# Altium project PCB Version 0.2.PrjPcb
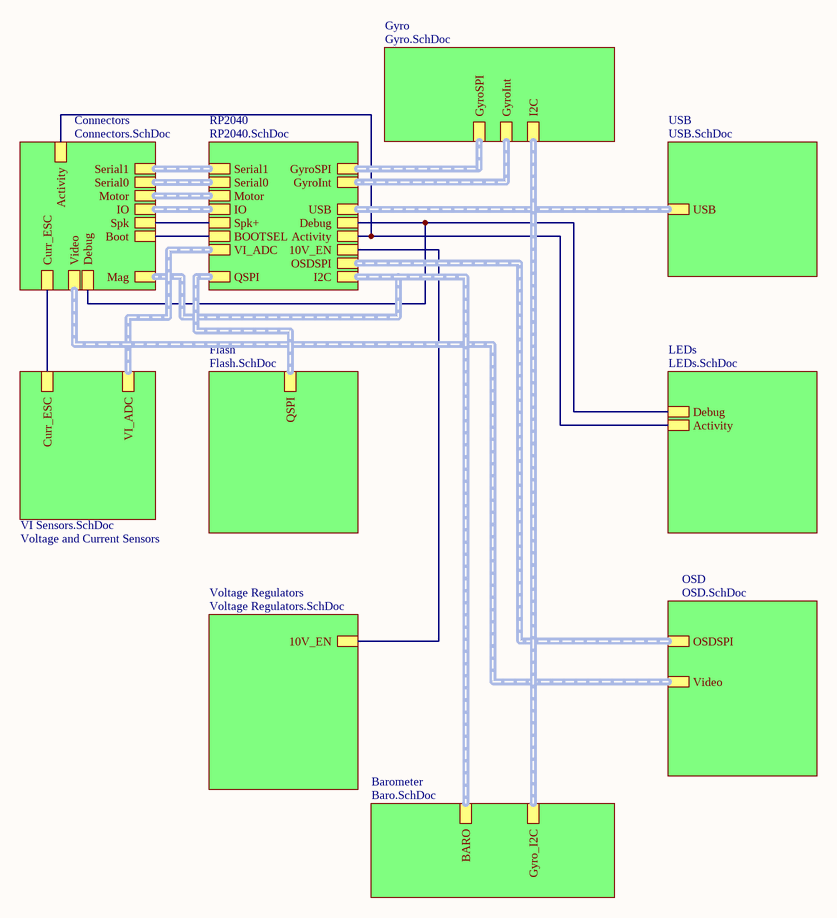
[diagram p0: Main.SchDoc]
10 sheets, 137 parts. Net scope: hierarchical (ports join the sheet entries above them; power ports are global).
Board file: PCB v0.2.PcbDoc
Sheets:
  Main.SchDoc
    RP2040 = RP2040.SchDoc
    Flash = Flash.SchDoc
    Voltage Regulators = Voltage Regulators.SchDoc
    USB = USB.SchDoc
    OSD = OSD.SchDoc
    Barometer = Baro.SchDoc
    Gyro = Gyro.SchDoc
    Connectors = Connectors.SchDoc
    Voltage and Current Sensors = VI Sensors.SchDoc

## Sheet Main.SchDoc
size A4; SheetNumber: 1; SheetTotal: 11

### Sub-sheets
Barometer = Baro.SchDoc: BARO, Gyro_I2C
Connectors = Connectors.SchDoc: Serial1, Motor, Mag, Serial0, Curr_ESC, IO, Video, Spk, Debug, Activity, Boot
Flash = Flash.SchDoc: QSPI
Gyro = Gyro.SchDoc: GyroSPI, GyroInt, I2C
LEDs = LEDs.SchDoc (file not in this document): Debug, Activity
OSD = OSD.SchDoc: OSDSPI, Video
RP2040 = RP2040.SchDoc: QSPI, USB, Debug, Activity, I2C, OSDSPI, GyroSPI, GyroInt, Serial1, Motor, Serial0, VI_ADC, IO, Spk+, 10V_EN, BOOTSEL
USB = USB.SchDoc: USB
Voltage and Current Sensors = VI Sensors.SchDoc: Curr_ESC, VI_ADC
Voltage Regulators = Voltage Regulators.SchDoc: 10V_EN

### Nets
Activity: sheet RP2040/Activity, sheet LEDs/Activity, sheet Connectors/Activity
Curr_ESC: sheet Connectors/Curr_ESC, sheet Voltage and Current Sensors/Curr_ESC
Debug: sheet RP2040/Debug, sheet LEDs/Debug, sheet Connectors/Debug
IO6: sheet RP2040/10V_EN, sheet Voltage Regulators/10V_EN
Spk+: sheet RP2040/Spk+, sheet Connectors/Spk
NetIC2_1: sheet RP2040/BOOTSEL, sheet Connectors/Boot

### Buses and harness runs
harness sheet Barometer/BARO = sheet Connectors/Mag = sheet RP2040/I2C
harness sheet Barometer/Gyro_I2C = sheet Gyro/I2C
harness sheet Connectors/IO = sheet RP2040/IO
harness sheet Connectors/Motor = sheet RP2040/Motor
harness sheet Connectors/Serial0 = sheet RP2040/Serial0
harness sheet Connectors/Serial1 = sheet RP2040/Serial1
harness sheet Connectors/Video = sheet OSD/Video
harness sheet Flash/QSPI = sheet RP2040/QSPI
harness sheet Gyro/GyroInt = sheet RP2040/GyroInt
harness sheet Gyro/GyroSPI = sheet RP2040/GyroSPI
harness sheet OSD/OSDSPI = sheet RP2040/OSDSPI
harness sheet RP2040/USB = sheet USB/USB
harness sheet RP2040/VI_ADC = sheet Voltage and Current Sensors/VI_ADC

## Sheet RP2040.SchDoc
size A4; SheetNumber: 2; SheetTotal: 11
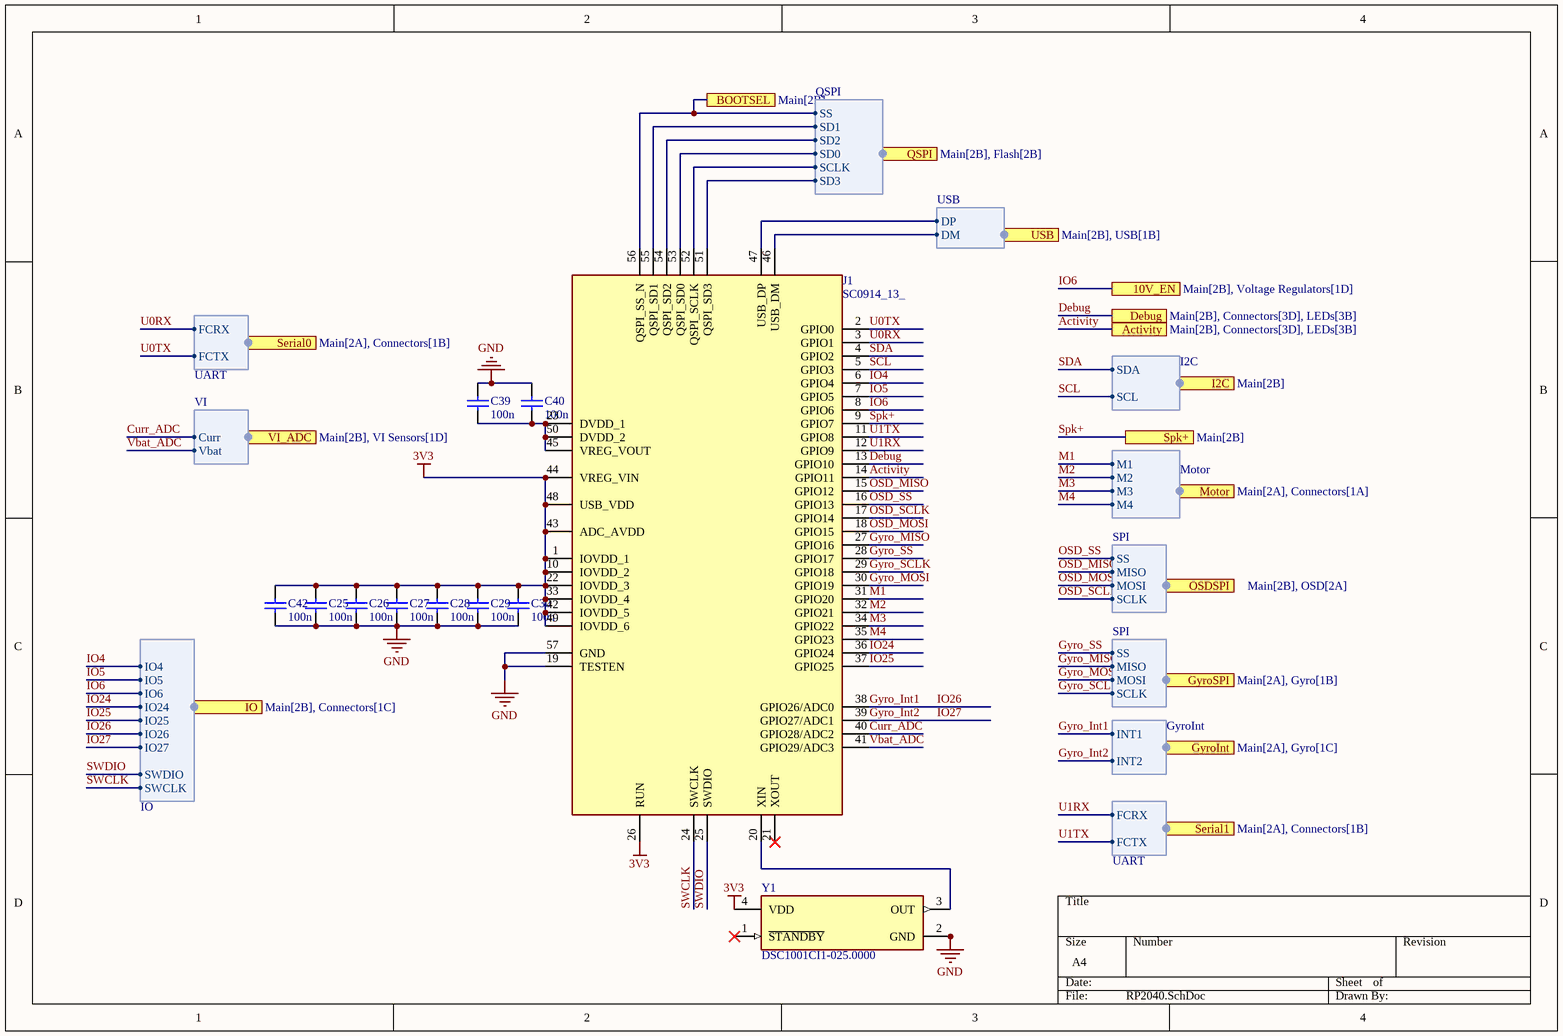
[diagram p1: RP2040.SchDoc]

### Parts
C25  100n  [CAPC0603(1608)55_N]
C26  100n  [CAPC0603(1608)55_N]
C27  100n  [CAPC0603(1608)55_N]
C28  100n  [CAPC0603(1608)55_N]
C29  100n  [CAPC0603(1608)55_N]
C30  100n  [CAPC0603(1608)55_N]
C39  100n  [CAPC0603(1608)55_N]
C40  100n  [CAPC0603(1608)55_N]
C42  100n  [CAPC0603(1608)55_N]
J1  SC0914_13_  [SC091413]
Y1  DSC1001CI1-025.0000  [FP-CDFN3225-4LD-PL-1-MFG]

### Ports
10V_EN (see Main[2B], Voltage Regulators[1D]), Activity (see Main[2B], Connectors[3D], LEDs[3B]), BOOTSEL (see Main[2B]), Debug (see Main[2B], Connectors[3D], LEDs[3B]), GyroInt (harness GyroInt, see Main[2A], Gyro[1C]), GyroSPI (harness SPI, see Main[2A], Gyro[1B]), I2C (harness I2C, see Main[2B]), IO (harness IO, see Main[2B], Connectors[1C]), Motor (harness Motor, see Main[2A], Connectors[1A]), OSDSPI (harness SPI, see Main[2B], OSD[2A]), QSPI (harness QSPI, see Main[2B], Flash[2B]), Serial0 (harness UART, see Main[2A], Connectors[1B]), Serial1 (harness UART, see Main[2A], Connectors[1B]), Spk+ (see Main[2B]), USB (harness USB, see Main[2B], USB[1B]), VI_ADC (harness VI, see Main[2B], VI Sensors[1D])

### Harnesses
QSPI: SS, SD1, SD2, SD0, SCLK, SD3
USB: DP, DM
I2C: SDA, SCL
SPI: SS, MISO, MOSI, SCLK
GyroInt: INT1, INT2
UART: FCRX, FCTX
Motor: M2, M4, M1, M3
VI: Curr, Vbat
IO: IO4, IO5, IO6, IO24, IO25, IO26, IO27, SWDIO, SWCLK

### Nets
3V3: C25.2 C26.2 C27.2 C28.2 C29.2 C30.2 C42.2 J1.1(IOVDD_1) J1.10(IOVDD_2) J1.22(IOVDD_3) J1.26(RUN) J1.33(IOVDD_4) J1.42(IOVDD_5) J1.43(ADC_AVDD) J1.44(VREG_VIN) J1.48(USB_VDD) J1.49(IOVDD_6) Y1.4(VDD)
GND: C25.1 C26.1 C27.1 C28.1 C29.1 C30.1 C39.2 C40.2 C42.1 J1.19(TESTEN) J1.57(GND) Y1.2(GND)
Activity: J1.14(GPIO11) ; port Activity
Curr_ADC: J1.40(GPIO28/ADC2) ; port VI_ADC.Curr
Debug: J1.13(GPIO10) ; port Debug
Gyro_Int1: J1.38(GPIO26/ADC0) ; port GyroInt.INT1, port IO.IO26  [also labelled IO26]
Gyro_Int2: J1.39(GPIO27/ADC1) ; port GyroInt.INT2, port IO.IO27  [also labelled IO27]
Gyro_MISO: J1.27(GPIO16) ; port GyroSPI.MISO
Gyro_MOSI: J1.30(GPIO19) ; port GyroSPI.MOSI
Gyro_SCLK: J1.29(GPIO18) ; port GyroSPI.SCLK
Gyro_SS: J1.28(GPIO17) ; port GyroSPI.SS  [project net CSB]
IO4: J1.6(GPIO4) ; port IO.IO4
IO5: J1.7(GPIO5) ; port IO.IO5
IO6: J1.8(GPIO6) ; port 10V_EN, port IO.IO6
IO24: J1.36(GPIO24) ; port IO.IO24
IO25: J1.37(GPIO25) ; port IO.IO25
M1: J1.31(GPIO20) ; port Motor.M1
M2: J1.32(GPIO21) ; port Motor.M2
M3: J1.34(GPIO22) ; port Motor.M3
M4: J1.35(GPIO23) ; port Motor.M4
OSD_MISO: J1.15(GPIO12) ; port OSDSPI.MISO  [project net MISO]
OSD_MOSI: J1.18(GPIO15) ; port OSDSPI.MOSI  [project net MOSI]
OSD_SCLK: J1.17(GPIO14) ; port OSDSPI.SCLK
OSD_SS: J1.16(GPIO13) ; port OSDSPI.SS
SCL: J1.5(GPIO3) ; port I2C.SCL
SDA: J1.4(GPIO2) ; port I2C.SDA
Spk+: J1.9(GPIO7) ; port Spk+
SWCLK: J1.24(SWCLK) ; port IO.SWCLK
SWDIO: J1.25(SWDIO) ; port IO.SWDIO
U0RX: J1.3(GPIO1) ; port Serial0.FCRX
U0TX: J1.2(GPIO0) ; port Serial0.FCTX
U1RX: J1.12(GPIO9) ; port Serial1.FCRX
U1TX: J1.11(GPIO8) ; port Serial1.FCTX
Vbat_ADC: J1.41(GPIO29/ADC3) ; port VI_ADC.Vbat
NetC39_1: C39.1 C40.1 J1.23(DVDD_1) J1.45(VREG_VOUT) J1.50(DVDD_2)
NetIC2_1: J1.56(QSPI_SS_N) ; port BOOTSEL, port QSPI.SS
NetIC2_2: J1.55(QSPI_SD1) ; port QSPI.SD1
NetIC2_3: J1.54(QSPI_SD2) ; port QSPI.SD2
NetIC2_5: J1.53(QSPI_SD0) ; port QSPI.SD0
NetIC2_6: J1.52(QSPI_SCLK) ; port QSPI.SCLK
NetIC2_7: J1.51(QSPI_SD3) ; port QSPI.SD3
NetJ1_20: J1.20(XIN) Y1.3(OUT)
NetJ1_46: J1.46(USB_DM) ; port USB.DM
NetJ1_47: J1.47(USB_DP) ; port USB.DP

Not connected (* = marked no-connect by the designer): J1 21(XOUT)*; Y1 1(~{STANDBY})*

### Library data of the parts
C25-C30 C39 C40 C42 = Cap 100n: Keramikvielschichtkondensator, SMD, Baureihe MC, ± 20%; Manufacturer: Multicomp; OC_FARNELL: 1759038; Value: 100n; PackageReference: 0603
J1 = SC0914_13_: Connector; Manufacturer_Name: RASPBERRY-PI; Manufacturer_Part_Number: SC0914(13); Datasheet Link: https://datasheets.raspberrypi.com/rp2040/rp2040-datasheet.pdf; Height: 0.9mm; Mouser Part Number: 358-SC091413; Mouser Price/Stock: https://www.mouser.co.uk/ProductDetail/Raspberry-Pi/SC091413?qs=T%252BzbugeAwjhr%252BUbBr3TJcw%3D%3D
Y1 = CMP-06255-000034-1: MEMS OSC XO 25.0000MHZ CMOS SMD; Load Capacitance: 15pF; Max Supply Voltage: 3.6V; Min Supply Voltage: 2.7V; Max Supply Current: 6.3mA; Frequency Stability: 50ppm; Frequency: 25MHz; Max Duty Cycle: 55%; Number of Pins: 4; Height: 0.035inch; Packaging: Rail/Tube; Max Operating Temperature: 85°C; Length: 0.126inch; Case/Package: SMD/SMT; Series: DSC1001; Width: 0.098inch; Termination: SMD/SMT; Package Quantity: 110; Mount: Surface Mount; Ratings: AEC-Q100; Min Operating Temperature: -40°C

## Sheet Flash.SchDoc
size A4; SheetNumber: 5; SheetTotal: 11
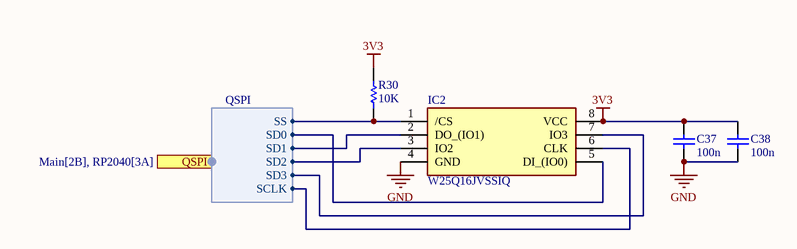
[diagram p2: Flash.SchDoc]

### Parts
C37  100n  [CAPC0603(1608)55_N]
C38  100n  [CAPC0603(1608)55_N]
IC2  W25Q16JVSSIQ  [SOIC127P790X216-8N]
R30  10K  [RESC0603(1608)_N]

### Ports
QSPI (harness QSPI, see Main[2B], RP2040[3A])

### Harnesses
QSPI: SS, SD0, SD1, SD2, SD3, SCLK

### Nets
3V3: C37.2 C38.2 IC2.8(VCC) R30.2
GND: C37.1 C38.1 IC2.4(GND)
NetIC2_1: IC2.1(/CS) R30.1 ; port QSPI.SS
NetIC2_2: IC2.2(DO_(IO1)) ; port QSPI.SD1
NetIC2_3: IC2.3(IO2) ; port QSPI.SD2
NetIC2_5: IC2.5(DI_(IO0)) ; port QSPI.SD0
NetIC2_6: IC2.6(CLK) ; port QSPI.SCLK
NetIC2_7: IC2.7(IO3) ; port QSPI.SD3

### Library data of the parts
C37 C38 = Cap 100n: as C25 on sheet RP2040; OC_FARNELL: 1759038; Value: 100n; PackageReference: 0603
IC2 = W25Q16JVSSIQ: Integrated Circuit; Manufacturer_Name: Winbond; Datasheet Link: https://www.winbond.com/hq/search-resource-file.jsp?partNo=W25Q16JVSSIQ&type=datasheet; Height: 2.16mm; Manufacturer_Part_Number: W25Q16JVSSIQ; Mouser Part Number: 454-W25Q16JVSSIQ; Mouser Price/Stock: https://www.mouser.co.uk/ProductDetail/Winbond/W25Q16JVSSIQ?qs=qSfuJ%252Bfl%2Fd46L%2F1QrQC%2Fog%3D%3D; Arrow Part Number: W25Q16JVSSIQ; Arrow Price/Stock: https://www.arrow.com/en/products/w25q16jvssiq/winbond-electronics?region=nac
R30 = Res 100K: Chipwiderstand, SMD, Baureihe MC, 1%; Manufacturer: Multicomp; Value: 100K; PackageReference: 0603; OC_FARNELL: 9330402

## Sheet Voltage Regulators.SchDoc
size A4; SheetNumber: 4; SheetTotal: 11
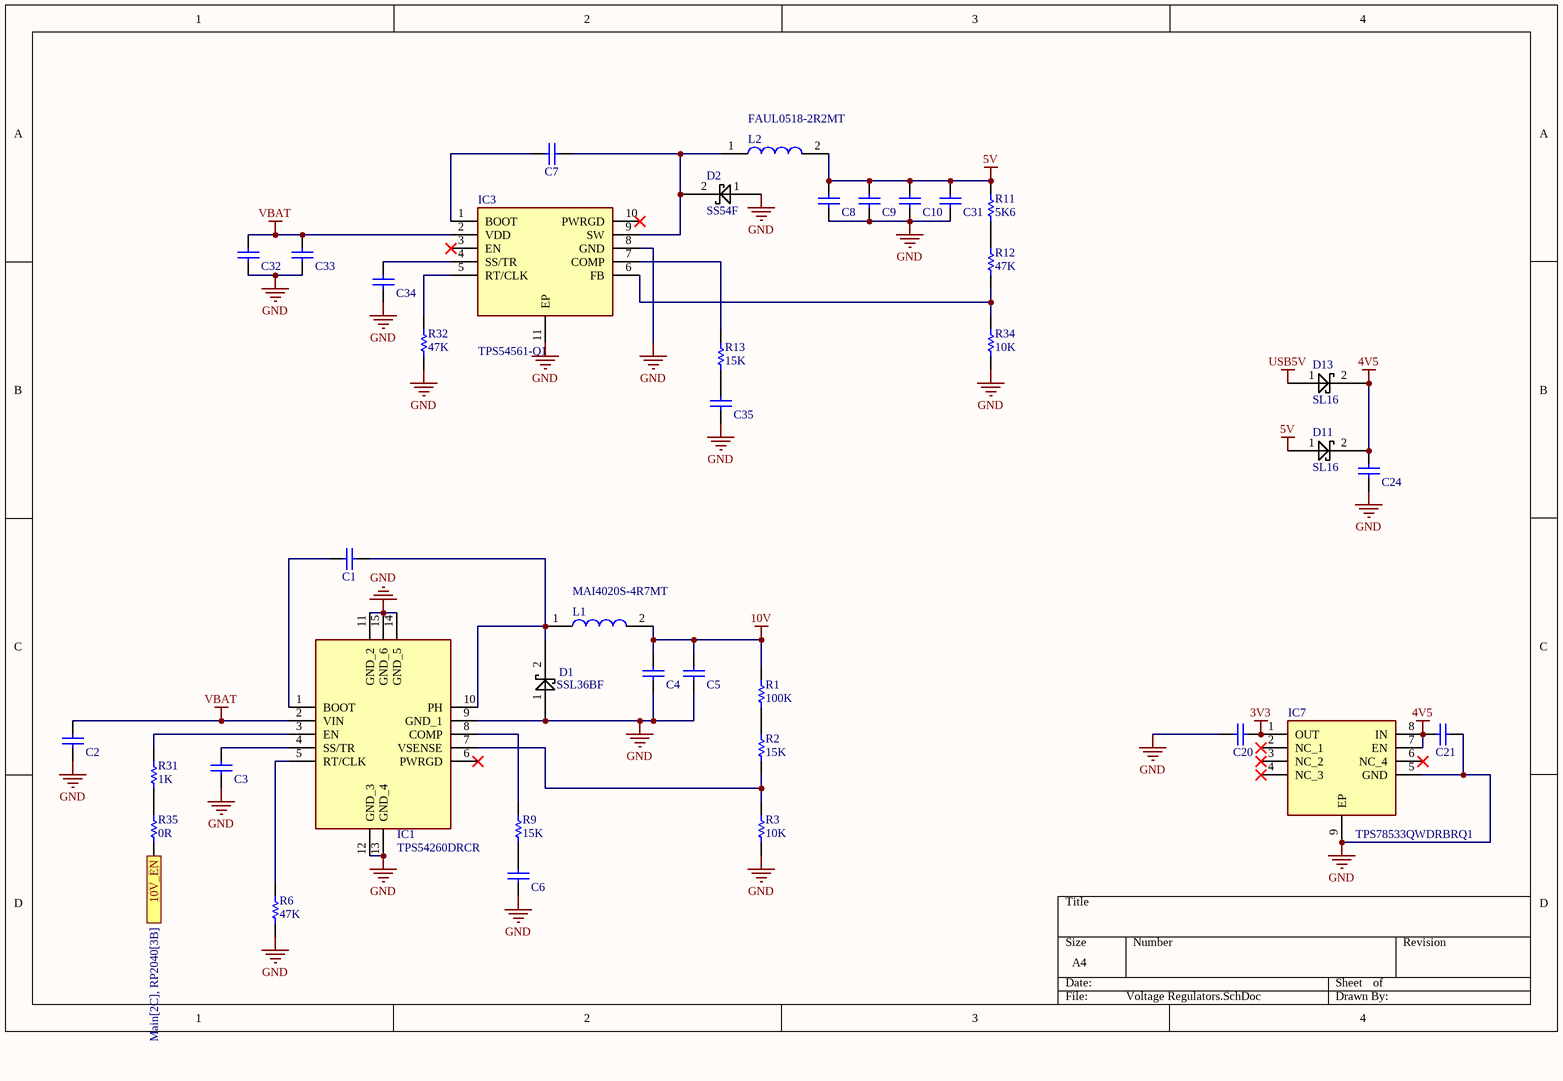
[diagram p3: Voltage Regulators.SchDoc]

### Parts
C1  100nF  [WCAP-CSGP_0603_L1.6W0.8H0.8_Reflow]  (value not drawn)
C2  3.3µF  [WCAP-CSGP_1206_L3.2W1.6H1.6]  (value not drawn)
C3  10nF  [WCAP-CSGP_0603_L1.6W0.8H0.8_Reflow]  (value not drawn)
C4  4.7µF  [WCAP-CSGP_0805_L2W1.25H1.25]  (value not drawn)
C5  4.7µF  [WCAP-CSGP_0805_L2W1.25H1.25]  (value not drawn)
C6  2.5pF  [WCAP-CSGP_0603_L1.6W0.8H0.8_Reflow]  (value not drawn)
C7  100nF  [WCAP-CSGP_0603_L1.6W0.8H0.8_Reflow]  (value not drawn)
C8  4.7µF  [WCAP-CSGP_0805_L2W1.25H1.25]  (value not drawn)
C9  4.7µF  [WCAP-CSGP_0805_L2W1.25H1.25]  (value not drawn)
C10  4.7µF  [WCAP-CSGP_0805_L2W1.25H1.25]  (value not drawn)
C20  1µF  [WCAP-CSGP_0603_L1.6W0.8H0.8_Reflow]  (value not drawn)
C21  1µF  [WCAP-CSGP_0603_L1.6W0.8H0.8_Reflow]  (value not drawn)
C24  1µF  [WCAP-CSGP_0603_L1.6W0.8H0.8_Reflow]  (value not drawn)
C31  4.7µF  [WCAP-CSGP_0805_L2W1.25H1.25]  (value not drawn)
C32  2.2µF  [WCAP-CSGP_0805_L2W1.25H1.25]  (value not drawn)
C33  2.2µF  [WCAP-CSGP_0805_L2W1.25H1.25]  (value not drawn)
C34  10nF  [WCAP-CSGP_0603_L1.6W0.8H0.8_Reflow]  (value not drawn)
C35  1nF  [WCAP-CSGP_0603_L1.6W0.8H0.8_Reflow]  (value not drawn)
D1  SSL36BF  [SSL36BF]
D2  SS54F  [SS54F]
D11  SL16  [SL16]
D13  SL16  [SL16]
IC1  TPS54260DRCR  [TPS54040ADRCT]
IC3  TPS54561-Q1  [SON80P400X400X80-11N]
IC7  TPS78533QWDRBRQ1  [SON65P300X300X100-9N-D]
L1  MAI4020S-4R7MT  [MAI4020S-4R7MT]
L2  FAUL0518-2R2MT  [FAUL0518-2R2MT]
R1  100K  [RESC0603(1608)_N]
R2  15K  [RESC0603(1608)_N]
R3  10K  [RESC0603(1608)_N]
R6  47K  [RESC0603(1608)_N]
R9  15K  [RESC0603(1608)_N]
R11  5K6  [RESC0603(1608)_N]
R12  47K  [RESC0603(1608)_N]
R13  15K  [RESC0603(1608)_N]
R31  1K  [RESC0603(1608)_N]
R32  47K  [RESC0603(1608)_N]
R34  10K  [RESC0603(1608)_N]
R35  0R  [RESC0603(1608)_N]

### Ports
10V_EN (see Main[2C], RP2040[3B])

### Nets
3V3: C20.2 IC7.1(OUT)
4V5: C21.1 C24.2 D11.2 D13.2 IC7.7(EN) IC7.8(IN)
5V: C8.2 C9.2 C10.2 C31.2 D11.1 L2.2 R11.2
10V: C4.2 C5.2 L1.2 R1.2
GND: C2.1 C3.1 C4.1 C5.1 C6.1 C8.1 C9.1 C10.1 C20.1 C21.2 C24.1 C31.1 C32.1 C33.1 C34.1 C35.1 D1.1 D2.1 IC1.9(GND_1) IC1.11(GND_2) IC1.12(GND_3) IC1.13(GND_4) IC1.14(GND_5) IC1.15(GND_6) IC3.8(GND) IC3.11(EP) IC7.5(GND) IC7.9(EP) R3.1 R6.1 R32.1 R34.1
USB5V: D13.1
VBAT: C2.2 C32.2 C33.2 IC1.2(VIN) IC3.2(VDD)
IO6: R35.1 ; port 10V_EN
NetC1_1: C1.1 IC1.1(BOOT)
NetC1_2: C1.2 D1.2 IC1.10(PH) L1.1
NetC3_2: C3.2 IC1.4(SS/TR)
NetC6_2: C6.2 R9.1
NetC7_1: C7.1 IC3.1(BOOT)
NetC7_2: C7.2 D2.2 IC3.9(SW) L2.1
NetC34_2: C34.2 IC3.4(SS/TR)
NetC35_2: C35.2 R13.1
NetIC1_3: IC1.3(EN) R31.2
NetIC1_5: IC1.5(RT/CLK) R6.2
NetIC1_7: IC1.7(VSENSE) R2.1 R3.2
NetIC1_8: IC1.8(COMP) R9.2
NetIC3_5: IC3.5(RT/CLK) R32.2
NetIC3_6: IC3.6(FB) R12.1 R34.2
NetIC3_7: IC3.7(COMP) R13.2
NetR1_1: R1.1 R2.2
NetR11_1: R11.1 R12.2
NetR31_1: R31.1 R35.2

Not connected (* = marked no-connect by the designer): IC1 6(PWRGD)*; IC3 3(EN)* 10(PWRGD)*; IC7 2(NC_1)* 3(NC_2)* 4(NC_3)* 6(NC_4)*

### Library data of the parts
C1 C7 = 885012206046: WCAP-CSGP Multilayer Ceramic Chip Capacitor, General Purpose, size 0603, X7R, 100nF, 16VDC; Manufacturer: Wurth Elektronik; Case/Size Code: 0603; Capacitance Tolerance: +/-10%; Dissipation Factor: 3.5%; Insulation Resistance: 5GΩ; Rated Voltage (DC): 16V; Technical Reference: X7R0603104K016DFCT10000; ComponentLink1Description: Website Link; ComponentLink1URL: https://www.we-online.com/redexpert/article/885012206046?ad; ComponentLink2Description: Datasheet Link; ComponentLink2URL: https://www.we-online.com/redexpert/spec/885012206046?ad; Manufacturer Part Number: 885012206046; Category: Multilayer Ceramic Chip Capacitors; Match Code: WCAP-CSGP; Mount: Surface Mount; Operating Temperature Max: 125°C; Operating Temperature Min: -55°C; Packaging: Tape and Reel; Length: 1.6mm; Width: 0.8mm; Height: 0.8mm; Capacitance: 100nF; Ceramic Type: X7R
C2 = 885012208124: TDK C3216X7S2A335KT000N / 3.3µF MLCC 1206 100V X7S; Manufacturer: Wurth Elektronik; Match Code: WCAP-CSGP; Case/Size Code: 1206; Capacitance: 2.2µF; Capacitance Tolerance: +/-10%; Ceramic Type: X7R; Dissipation Factor: 5%; Insulation Resistance: 0.05GΩ; Technical Reference: X7R1206225K100DFCT10000; ComponentLink1Description: Website Link; ComponentLink1URL: https://www.we-online.com/redexpert/article/885012208124?ad; ComponentLink2Description: Datasheet Link; ComponentLink2URL: https://www.we-online.com/redexpert/spec/885012208124?ad; Manufacturer Part Number: 885012208124; Category: Multilayer Ceramic Chip Capacitors; Mount: Surface Mount; Operating Temperature Max: 125°C; Operating Temperature Min: -55°C; Packaging: Tape and Reel; Length: 3.2mm; Width: 1.6mm; Height: 1.6mm; Rated Voltage (DC): 100V
C3 C34 = 885012206040: WCAP-CSGP Multilayer Ceramic Chip Capacitor, General Purpose, size 0603, X7R, 10nF, 16VDC; Manufacturer: Wurth Elektronik; Case/Size Code: 0603; Capacitance Tolerance: +/-10%; Dissipation Factor: 3.5%; Insulation Resistance: 10GΩ; Rated Voltage (DC): 16V; Technical Reference: X7R0603103K016DFCT10000; ComponentLink1Description: Website Link; ComponentLink1URL: https://www.we-online.com/redexpert/article/885012206040?ad; ComponentLink2Description: Datasheet Link; ComponentLink2URL: https://www.we-online.com/redexpert/spec/885012206040?ad; Manufacturer Part Number: 885012206040; Category: Multilayer Ceramic Chip Capacitors; Match Code: WCAP-CSGP; Mount: Surface Mount; Operating Temperature Max: 125°C; Operating Temperature Min: -55°C; Packaging: Tape and Reel; Length: 1.6mm; Width: 0.8mm; Height: 0.8mm; Capacitance: 10nF; Ceramic Type: X7R
C4 C5 C8-C10 C31 = 885012107013: CL21A475KAQNNNG; Manufacturer: Wurth Elektronik; Match Code: WCAP-CSGP; Case/Size Code: 0805; Capacitance Tolerance: +/-20%; Ceramic Type: X5R; Dissipation Factor: 10%; Insulation Resistance: 0.02GΩ; Rated Voltage (DC): 16V; Technical Reference: X5R0805475M016DFCT10000; ComponentLink1Description: Website Link; ComponentLink1URL: https://www.we-online.com/redexpert/article/885012107013?ad; ComponentLink2Description: Datasheet Link; ComponentLink2URL: https://www.we-online.com/redexpert/spec/885012107013?ad; Manufacturer Part Number: 885012107013; Category: Multilayer Ceramic Chip Capacitors; Mount: Surface Mount; Operating Temperature Max: 85°C; Operating Temperature Min: -55°C; Packaging: Tape and Reel; Length: 2mm; Width: 1.25mm; Height: 1.25mm; Capacitance: 4.7µF
C6 C35 = 885012006030: TCC0603COG2R5C500CT; Manufacturer: Wurth Elektronik; Match Code: WCAP-CSGP; Case/Size Code: 0603; Capacitance: 4.7pF; Capacitance Tolerance: +/-0.5pF; Ceramic Type: NP0; Insulation Resistance: 10GΩ; Q Factor: 494; Rated Voltage (DC): 25V; Technical Reference: NP006034R7D025DFCT10000; ComponentLink1Description: Website Link; ComponentLink1URL: https://www.we-online.com/redexpert/article/885012006030?ad; ComponentLink2Description: Datasheet Link; ComponentLink2URL: https://www.we-online.com/redexpert/spec/885012006030?ad; Manufacturer Part Number: 885012006030; Category: Multilayer Ceramic Chip Capacitors; Mount: Surface Mount; Operating Temperature Max: 125°C; Operating Temperature Min: -55°C; Packaging: Tape and Reel; Length: 1.6mm; Width: 0.8mm; Height: 0.8mm
C20 C21 = 885012206026: WCAP-CSGP Multilayer Ceramic Chip Capacitor, General Purpose, size 0603, X7R, 1µF, 10VDC; Manufacturer: Wurth Elektronik; Case/Size Code: 0603; Capacitance Tolerance: +/-10%; Dissipation Factor: 10%; Insulation Resistance: 0.1GΩ; Rated Voltage (DC): 10V; Technical Reference: X7R0603105K010DFCT10000; ComponentLink1Description: Website Link; ComponentLink1URL: https://www.we-online.com/redexpert/article/885012206026?ad; ComponentLink2Description: Datasheet Link; ComponentLink2URL: https://www.we-online.com/redexpert/spec/885012206026?ad; Manufacturer Part Number: 885012206026; Category: Multilayer Ceramic Chip Capacitors; Match Code: WCAP-CSGP; Mount: Surface Mount; Operating Temperature Max: 125°C; Operating Temperature Min: -55°C; Packaging: Tape and Reel; Length: 1.6mm; Width: 0.8mm; Height: 0.8mm; Capacitance: 1µF; Ceramic Type: X7R
C24 = 885012106017: WCAP-CSGP Multilayer Ceramic Chip Capacitor, General Purpose, size 0603, X5R, 1µF, 16VDC; Manufacturer: Wurth Elektronik; Case/Size Code: 0603; Capacitance Tolerance: +/-20%; Dissipation Factor: 10%; Insulation Resistance: 0.1GΩ; Rated Voltage (DC): 16V; Technical Reference: X5R0603105M016DFCT10000; ComponentLink1Description: Website Link; ComponentLink1URL: https://www.we-online.com/redexpert/article/885012106017?ad; ComponentLink2Description: Datasheet Link; ComponentLink2URL: https://www.we-online.com/redexpert/spec/885012106017?ad; Manufacturer Part Number: 885012106017; Category: Multilayer Ceramic Chip Capacitors; Match Code: WCAP-CSGP; Mount: Surface Mount; Operating Temperature Max: 85°C; Operating Temperature Min: -55°C; Packaging: Tape and Reel; Length: 1.6mm; Width: 0.8mm; Height: 0.8mm; Capacitance: 1µF; Ceramic Type: X5R
C32 C33 = 885012107013: CL21B225KBYNNNE; Manufacturer: Wurth Elektronik; Match Code: WCAP-CSGP; Case/Size Code: 0805; Capacitance: 4.7µF; Capacitance Tolerance: +/-20%; Ceramic Type: X5R; Dissipation Factor: 10%; Insulation Resistance: 0.02GΩ; Rated Voltage (DC): 16V; Technical Reference: X5R0805475M016DFCT10000; ComponentLink1Description: Website Link; ComponentLink1URL: https://www.we-online.com/redexpert/article/885012107013?ad; ComponentLink2Description: Datasheet Link; ComponentLink2URL: https://www.we-online.com/redexpert/spec/885012107013?ad; Manufacturer Part Number: 885012107013; Category: Multilayer Ceramic Chip Capacitors; Mount: Surface Mount; Operating Temperature Max: 85°C; Operating Temperature Min: -55°C; Packaging: Tape and Reel; Length: 2mm; Width: 1.25mm; Height: 1.25mm
IC1 = TPS54260DRCR: Integrated Circuit; Manufacturer_Name: Texas Instruments; Datasheet Link: http://www.ti.com/lit/gpn/TPS54040A; Height: 1mm; Manufacturer_Part_Number: TPS54260DRCR; Mouser Part Number: 595-TPS54260DRCR; Mouser Price/Stock: https://www.mouser.co.uk/ProductDetail/Texas-Instruments/TPS54260DRCR?qs=O1HRStiETChM7xK%2FSiuP6w%3D%3D; Arrow Part Number: TPS54260DRCR; Arrow Price/Stock: https://www.arrow.com/en/products/tps54260drcr/texas-instruments?region=nac
IC3 = TPS54561-Q1: Integrated Circuit; Manufacturer_Name: Texas Instruments; Datasheet Link: http://www.ti.com/lit/gpn/tps54561-q1; Height: 0.8mm; Manufacturer_Part_Number: TPS54561-Q1
IC7 = TPS78533QWDRBRQ1: Integrated Circuit; Manufacturer_Name: Texas Instruments; Datasheet Link: https://www.arrow.com/en/products/tps78533qwdrbrq1/texas-instruments?region=nac; Height: 1mm; Manufacturer_Part_Number: TPS78533QWDRBRQ1; Mouser Part Number: 595-TPS78533QWDRBRQ1; Mouser Price/Stock: https://www.mouser.co.uk/ProductDetail/Texas-Instruments/TPS78533QWDRBRQ1?qs=iLbezkQI%252BsiNbdqh2Ko9GQ%3D%3D; Arrow Part Number: TPS78533QWDRBRQ1; Arrow Price/Stock: https://www.arrow.com/en/products/tps78533qwdrbrq1/texas-instruments?region=nac
R1 = Res 100K: Chipwiderstand, SMD, Baureihe MC, 1%; Manufacturer: Multicomp; PackageReference: 0603; Value: 100K; OC_FARNELL: 9330402
R2 R9 R12 R13 = Res 12K: Chipwiderstand, SMD, Baureihe MC, 1%; Manufacturer: Multicomp; Value: 12K; PackageReference: 0603; OC_FARNELL: 9330518
R3 R34 = Res 10K: Chipwiderstand, SMD, Baureihe MC, 1%; Manufacturer: Multicomp; PackageReference: 0603; Value: 10K; OC_FARNELL: 9330399
R6 R32 = Res 47R: Chipwiderstand, SMD, Baureihe MC, 1%; Manufacturer: Multicomp; Value: 47R; PackageReference: 0603; OC_FARNELL: 1576259
R11 = Res 100K: as R30 on sheet Flash; PackageReference: 0603; OC_FARNELL: 9330402
R31 = Res 1K: Chipwiderstand, SMD, Baureihe MC, 1%; Manufacturer: Multicomp; PackageReference: 0603; Value: 1K; OC_FARNELL: 9330380
R35 = Res 0R: Chipwiderstand, SMD, Baureihe MC, 1%; Manufacturer: Multicomp; PackageReference: 0603; Value: 0R; OC_FARNELL: 9331662

## Sheet USB.SchDoc
size A4; SheetNumber: 6; SheetTotal: 11
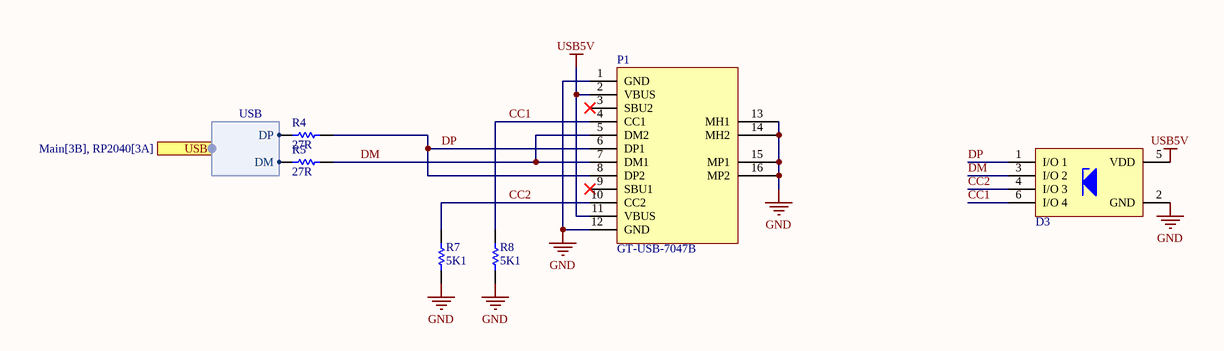
[diagram p4: USB.SchDoc]

### Parts
D3  3.3V  [WE-TVS_SOT23-6L]  (value not drawn)
P1  GT-USB-7047B  [GT-USB-7047B]
R4  27R  [RESC0603(1608)_N]
R5  27R  [RESC0603(1608)_N]
R7  5K1  [RESC0603(1608)_N]
R8  5K1  [RESC0603(1608)_N]

### Ports
USB (harness USB, see Main[3B], RP2040[3A])

### Harnesses
USB: DP, DM

### Nets
GND: D3.2(GND) P1.1(GND) P1.12(GND) P1.13(MH1) P1.14(MH2) P1.15(MP1) P1.16(MP2) R7.1 R8.1
USB5V: D3.5(VDD) P1.2(VBUS) P1.11(VBUS)
CC1: D3.6(I/O_4) P1.4(CC1) R8.2
CC2: D3.4(I/O_3) P1.10(CC2) R7.2
DM: D3.3(I/O_2) P1.5(DM2) P1.7(DM1) R5.2
DP: D3.1(I/O_1) P1.6(DP1) P1.8(DP2) R4.2
NetJ1_46: R5.1 ; port USB.DM
NetJ1_47: R4.1 ; port USB.DP

Not connected (* = marked no-connect by the designer): P1 3(SBU2)* 9(SBU1)*

### Library data of the parts
D3 = 824015043: Shenzhen JingYang TT0514VL; Manufacturer: Wurth Elektronik; Match Code: WE-TVS; Case/Size Code: SOT23-6L; Channel ESD Clamping Voltage: 7.5V; Channel Input Capacitance: 2pF; Channel Reverse Leakage Current: 1µA; ESD Air Discharge Capability: 30kV; Number of Channels: 4+1; Polarity: Unidirectional; (Reverse) Breakdown Voltage: 4.5V; (Reverse) Peak Pulse Current: 30A; ComponentLink1Description: Website Link; ComponentLink1URL: https://www.we-online.com/redexpert/article/824015043?ad; ComponentLink2Description: Datasheet Link; ComponentLink2URL: https://www.we-online.com/redexpert/spec/824015043?ad; Manufacturer Part Number: 824015043; Category: ESD Protection; Mount: Surface Mount; Operating Temperature Max: 125°C; Operating Temperature Min: -55°C; Packaging: Tape and Reel; Length: 2.9mm; Width: 2.8mm; Height: 1.45mm; Channel Operating Voltage: 3.3V; ESD Contact Discharge Capability: 30kV
R4 R5 = Res 27R: Chipwiderstand, Oberflächenmontage, Dickschicht, 27 ohm, 50 V, 0603 [Metrisch 1608], 100 mW, ± 1%; Manufacturer: Multicomp; PackageReference: 0603; Value: 27R; OC_FARNELL: 2447316
R7 R8 = Res 5K6: Chipwiderstand, SMD, Baureihe MC, 5%; Manufacturer: Multicomp; Value: 5K6; PackageReference: 0603; OC_FARNELL: 9332219

## Sheet OSD.SchDoc
size A4; SheetNumber: 7; SheetTotal: 11
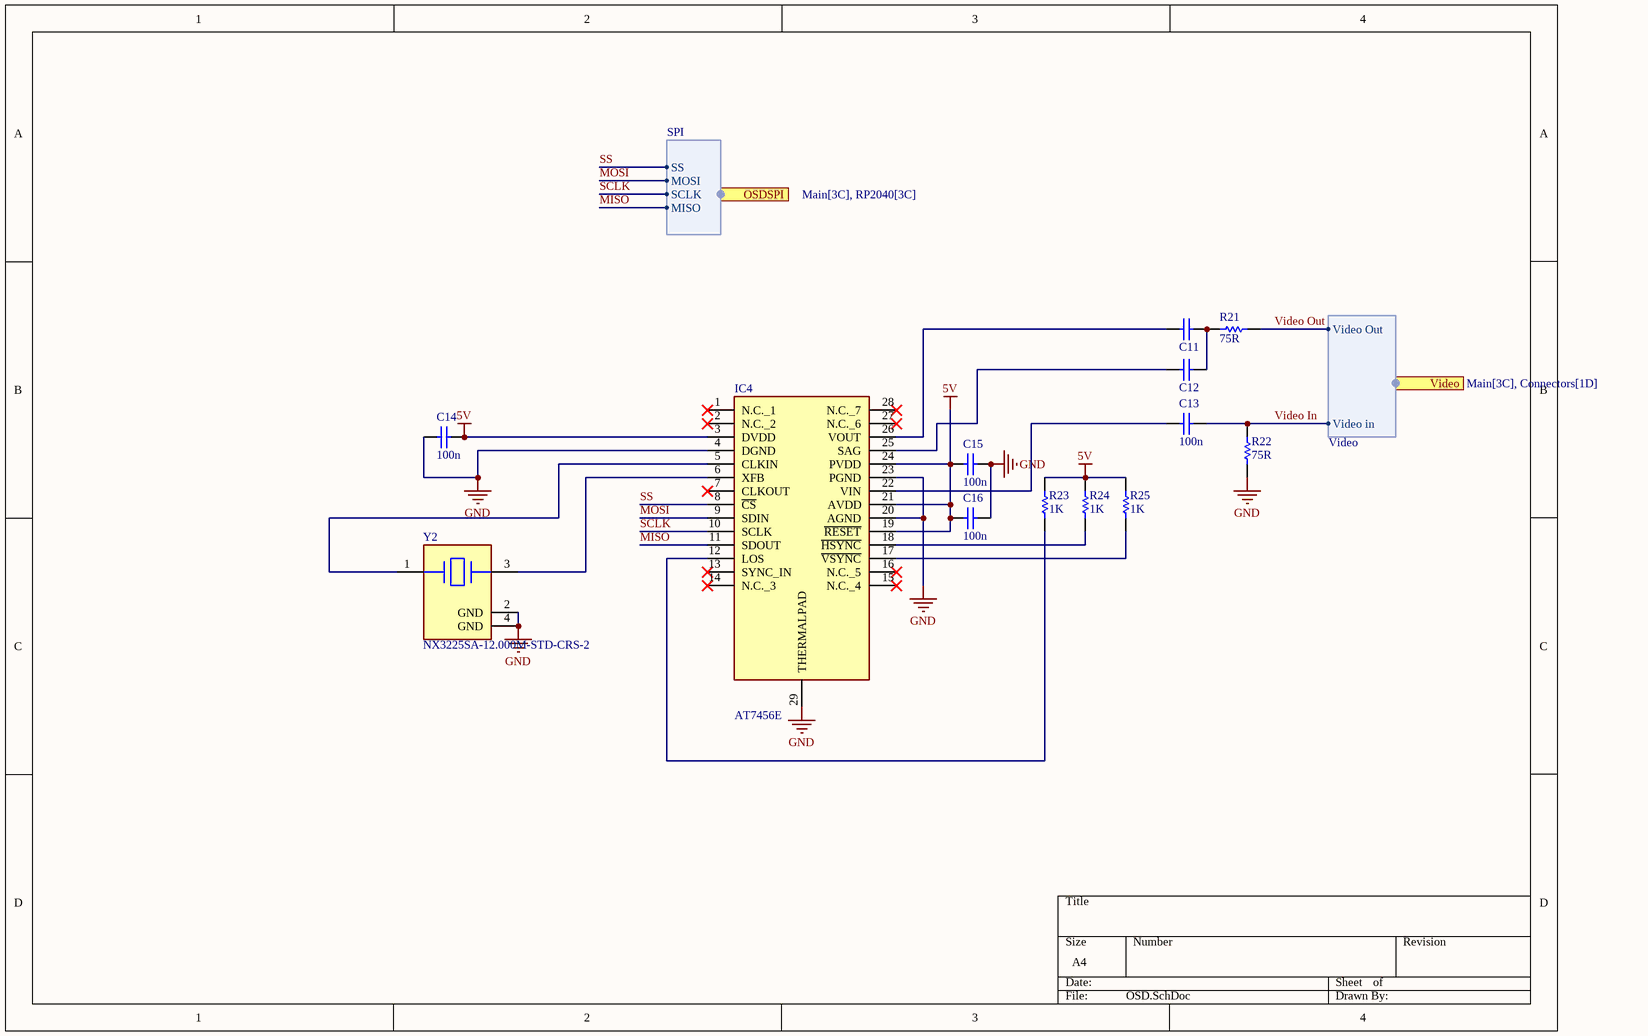
[diagram p5: OSD.SchDoc]

### Parts
C11  10µF  [WCAP-CSGP_0603_L1.6W0.8H0.8_Reflow]  (value not drawn)
C12  10µF  [WCAP-CSGP_0603_L1.6W0.8H0.8_Reflow]  (value not drawn)
C13  100n  [CAPC0603(1608)55_N]
C14  100n  [CAPC0603(1608)55_N]
C15  100n  [CAPC0603(1608)55_N]
C16  100n  [CAPC0603(1608)55_N]
IC4  AT7456E  [SOP65P640X120-29N]
R21  75R  [RESC0603(1608)_N]
R22  75R  [RESC0603(1608)_N]
R23  1K  [RESC0603(1608)_N]
R24  1K  [RESC0603(1608)_N]
R25  1K  [RESC0603(1608)_N]
Y2  NX3225SA-12.000M-STD-CRS-2  [FP-NX3225SA-MFG]

### Ports
OSDSPI (harness SPI, see Main[3C], RP2040[3C]), Video (harness Video, see Main[3C], Connectors[1D])

### Harnesses
SPI: SS, MOSI, SCLK, MISO
Video: Video Out, Video in

### Nets
5V: C14.2 C15.1 C16.1 IC4.3(DVDD) IC4.19(~{RESET}) IC4.21(AVDD) IC4.24(PVDD) R23.2 R24.2 R25.2
GND: C14.1 C15.2 C16.2 IC4.4(DGND) IC4.20(AGND) IC4.23(PGND) IC4.29(THERMALPAD) R22.1 Y2.2(GND) Y2.4(GND)
MISO: IC4.11(SDOUT) ; port OSDSPI.MISO
MOSI: IC4.9(SDIN) ; port OSDSPI.MOSI
SCLK: IC4.10(SCLK) ; port OSDSPI.SCLK  [project net OSD_SCLK]
SS: IC4.8(~{CS}) ; port OSDSPI.SS  [project net OSD_SS]
Video In: C13.2 R22.2 ; port Video.Video in
Video Out: R21.1 ; port Video.Video Out
NetC11_1: C11.1 IC4.26(VOUT)
NetC11_2: C11.2 C12.2 R21.2
NetC12_1: C12.1 IC4.25(SAG)
NetC13_1: C13.1 IC4.22(VIN)
NetIC4_5: IC4.5(CLKIN) Y2.1
NetIC4_6: IC4.6(XFB) Y2.3
NetIC4_12: IC4.12(LOS) R23.1
NetIC4_17: IC4.17(~{VSYNC}) R25.1
NetIC4_18: IC4.18(~{HSYNC}) R24.1

Not connected (* = marked no-connect by the designer): IC4 1(N.C._1)* 2(N.C._2)* 7(CLKOUT)* 13(SYNC_IN)* 14(N.C._3)* 15(N.C._4)* 16(N.C._5)* 27(N.C._6)* 28(N.C._7)*

### Library data of the parts
C11 C12 = 885012106031: WCAP-CSGP Multilayer Ceramic Chip Capacitor, General Purpose, size 0603, X5R, 10µF, 25VDC; Manufacturer: Wurth Elektronik; Case/Size Code: 0603; Capacitance Tolerance: +/20%; Dissipation Factor: 20%; Insulation Resistance: 0.01GΩ; Rated Voltage (DC): 25V; Technical Reference: X5R0603106M025DFCT10000; ComponentLink1Description: Website Link; ComponentLink1URL: https://www.we-online.com/redexpert/article/885012106031?ad; ComponentLink2Description: Datasheet Link; ComponentLink2URL: https://www.we-online.com/redexpert/spec/885012106031?ad; Manufacturer Part Number: 885012106031; Category: Multilayer Ceramic Chip Capacitors; Match Code: WCAP-CSGP; Mount: Surface Mount; Operating Temperature Max: 85°C; Operating Temperature Min: -55°C; Packaging: Tape and Reel; Length: 1.6mm; Width: 0.8mm; Height: 0.8mm; Capacitance: 10µF; Ceramic Type: X5R
C13-C16 = Cap 100n: as C25 on sheet RP2040; OC_FARNELL: 1759038; Value: 100n; PackageReference: 0603
IC4 = AT7456E: Integrated Circuit; Manufacturer_Name: ICOF; Datasheet Link: https://datasheet.lcsc.com/szlcsc/ZHONGKEWEI-AT7456E_C82351.pdf; Height: 1.2mm; Manufacturer_Part_Number: AT7456E
R21 R22 = Res 750R: Chipwiderstand, SMD, Baureihe MC, 1%; Manufacturer: Multicomp; Value: 750R; PackageReference: 0603; OC_FARNELL: 9331506
R23-R25 = Res 1K: as R31 on sheet Voltage Regulators; PackageReference: 0603; Value: 1K; OC_FARNELL: 9330380
Y2 = CMP-200220-000016-1: Frequency Tolerance: 15ppm; Frequency: 12MHz; Frequency Stability: 50ppm; ESR (Equivalent Series Resistance): 120R; Load Capacitance: 8pF; Case/Package: SMD/SMT; RoHS Compliant: Yes; Mount: Surface Mount; Ratings: AEC-Q200; Length: 0.126inch; Packaging: Tape and Reel; Width: 0.098inch; Min Operating Temperature: -40°C; Height: 0.024inch; Max Operating Temperature: 125°C

## Sheet Baro.SchDoc
size A4; SheetNumber: 8; SheetTotal: 11
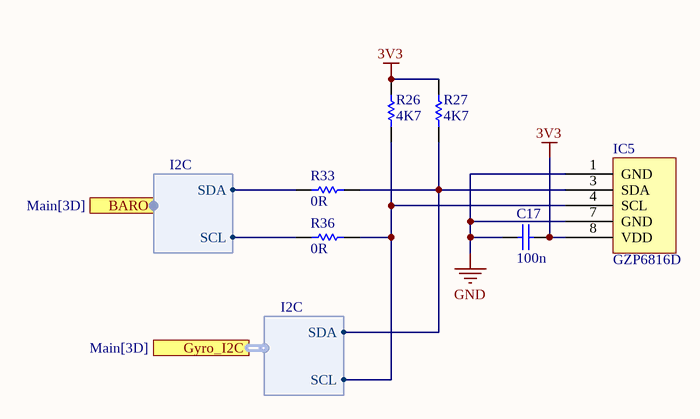
[diagram p6: Baro.SchDoc]

### Parts
C17  100n  [CAPC0603(1608)55_N]
IC5  GZP6816D  [GZP6816D]
R26  4K7  [RESC0603(1608)_N]
R27  4K7  [RESC0603(1608)_N]
R33  0R  [RESC1005X40X25NL05T10]
R36  0R  [RESC1005X40X25NL05T10]

### Ports
BARO (harness I2C, see Main[3D]), Gyro_I2C (harness I2C, see Main[3D])

### Harnesses
I2C: SDA, SCL

### Nets
3V3: C17.1 IC5.8(VDD) R26.2 R27.2
GND: C17.2 IC5.1(GND) IC5.7(GND)
SCL: R36.1 ; port BARO.SCL
SDA: R33.1 ; port BARO.SDA
NetIC5_3: IC5.3(SDA) R27.1 R33.2 ; port Gyro_I2C.SDA
NetIC5_4: IC5.4(SCL) R26.1 R36.2 ; port Gyro_I2C.SCL

### Library data of the parts
C17 = Cap 100n: as C25 on sheet RP2040; OC_FARNELL: 1759038; Value: 100n; PackageReference: 0603
R26 R27 = Res 4k7: Chipwiderstand, SMD, Baureihe MC, 5%; Manufacturer: Multicomp; PackageReference: 0603; Value: 4K7; OC_FARNELL: 9332154
R33 R36 = CMP-1011-00001-2: Manufacturer: Yageo / Phycomp; Part Number: RC0402JR-070RL

## Sheet Gyro.SchDoc
size A4; SheetNumber: 9; SheetTotal: 11
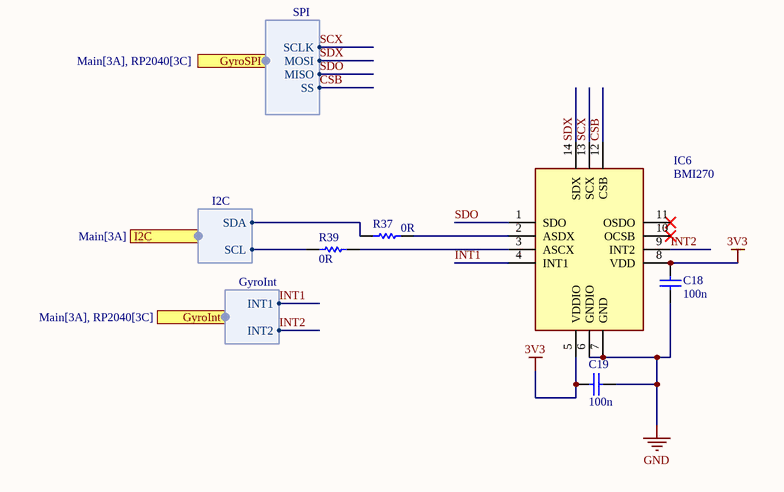
[diagram p7: Gyro.SchDoc]

### Parts
C18  100n  [CAPC0603(1608)55_N]
C19  100n  [CAPC0603(1608)55_N]
IC6  BMI270  [QFN50P300X250X87-14N]
R37  0R  [RESC1005X40X25NL05T10]
R39  0R  [RESC1005X40X25NL05T10]

### Ports
GyroInt (harness GyroInt, see Main[3A], RP2040[3C]), GyroSPI (harness SPI, see Main[3A], RP2040[3C]), I2C (harness I2C, see Main[3A])

### Harnesses
SPI: SS, MISO, MOSI, SCLK
GyroInt: INT1, INT2
I2C: SDA, SCL

### Nets
3V3: C18.2 C19.2 IC6.5(VDDIO) IC6.8(VDD)
GND: C18.1 C19.1 IC6.6(GNDIO) IC6.7(GND)
CSB: IC6.12(CSB) ; port GyroSPI.SS
INT1: IC6.4(INT1) ; port GyroInt.INT1  [project net Gyro_Int1]
INT2: IC6.9(INT2) ; port GyroInt.INT2  [project net Gyro_Int2]
SCX: IC6.13(SCX) ; port GyroSPI.SCLK  [project net Gyro_SCLK]
SDO: IC6.1(SDO) ; port GyroSPI.MISO  [project net Gyro_MISO]
SDX: IC6.14(SDX) ; port GyroSPI.MOSI  [project net Gyro_MOSI]
NetIC5_3: R37.1 ; port I2C.SDA
NetIC5_4: R39.1 ; port I2C.SCL
NetIC6_2: IC6.2(ASDX) R37.2
NetIC6_3: IC6.3(ASCX) R39.2

Not connected (* = marked no-connect by the designer): IC6 10(OCSB)* 11(OSDO)*

### Library data of the parts
C18 C19 = Cap 100n: as C25 on sheet RP2040; OC_FARNELL: 1759038; Value: 100n; PackageReference: 0603
IC6 = BMI270: Integrated Circuit; Manufacturer_Name: BOSCH; Datasheet Link: https://www.mouser.de/datasheet/2/783/BST-BMI270-FL000-1530947.pdf; Height: 0.87mm; Manufacturer_Part_Number: BMI270; Mouser Part Number: 262-BMI270; Mouser Price/Stock: https://www.mouser.co.uk/ProductDetail/Bosch-Sensortec/BMI270?qs=u16ybLDytRYIj%252BjQEee88A%3D%3D; Arrow Part Number: BMI270; Arrow Price/Stock: https://www.arrow.com/en/products/bmi270/bosch?region=nac
R37 R39 = CMP-1011-00001-2: as R33 on sheet Baro

## Sheet Connectors.SchDoc
size A4; SheetNumber: 10; SheetTotal: 11
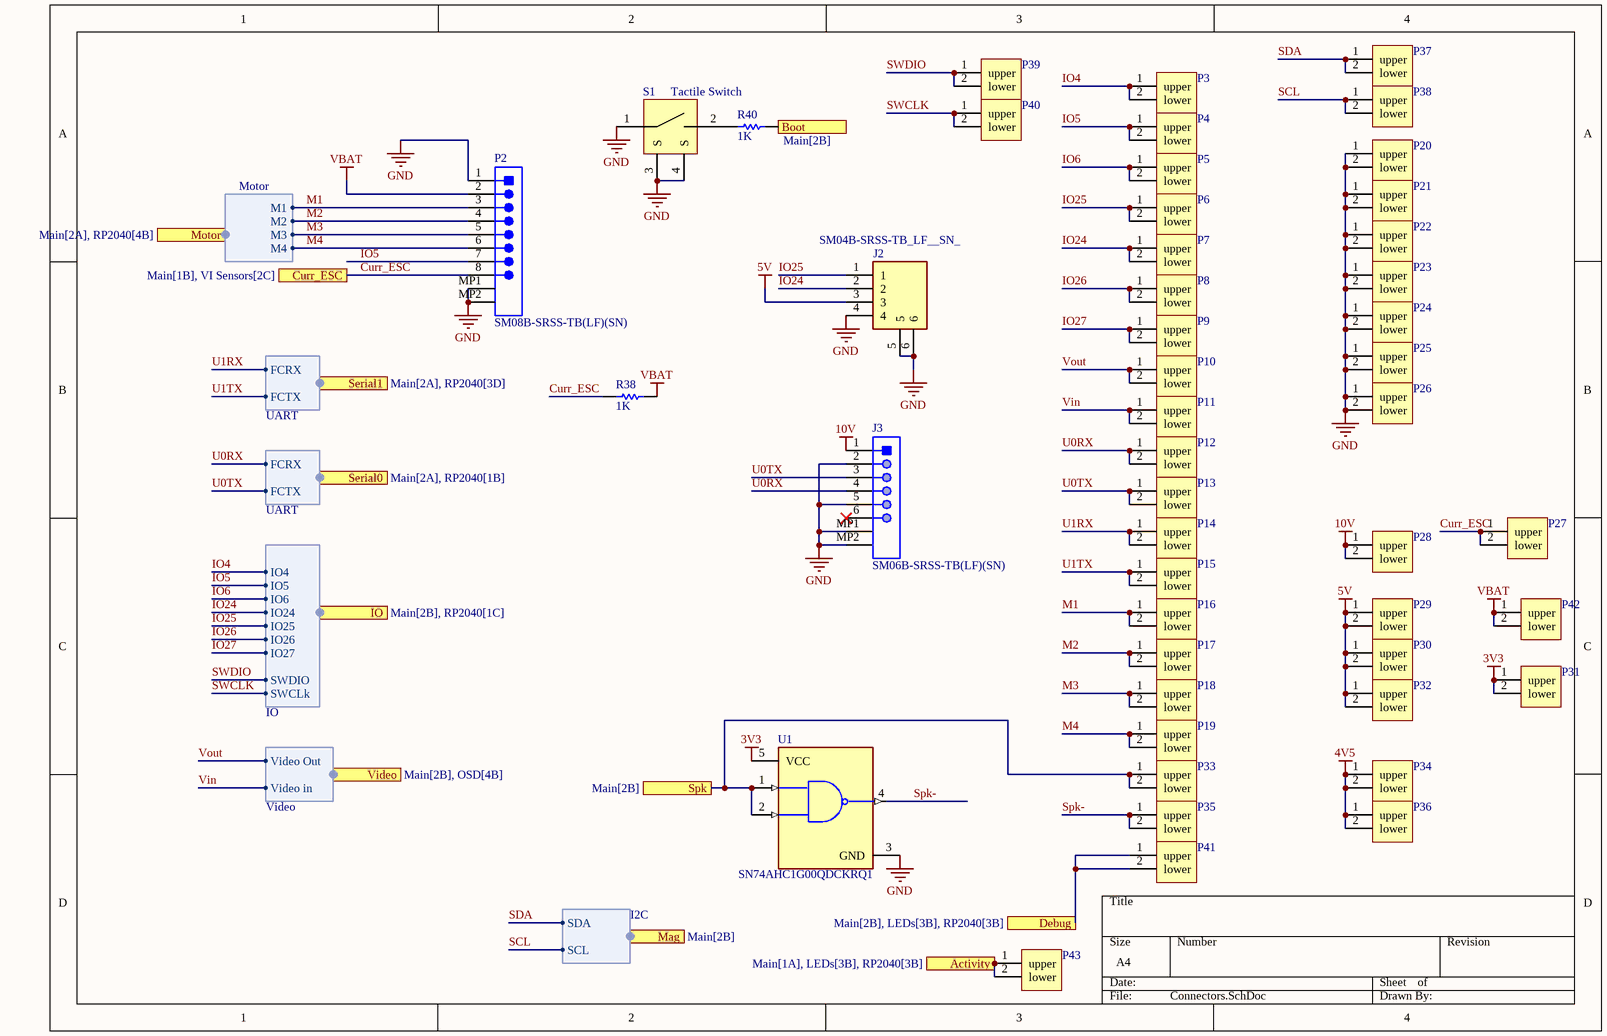
[diagram p8: Connectors.SchDoc]

### Parts
J2  SM04B-SRSS-TB_LF__SN_  [SM04B-SRSS-TB(LFSN)]
J3  SM06B-SRSS-TB(LF)(SN)  [JST-SM06B-SRSS-TB_V]
P2  SM08B-SRSS-TB(LF)(SN)  [JST-SM08B-SRSS-TB_V]
P3  solder pad rounded double sided  [solder pad double sided rounded - duplicate]  (value not drawn)
P4  solder pad rounded double sided  [solder pad double sided rounded - duplicate]  (value not drawn)
P5  solder pad rounded double sided  [solder pad double sided rounded - duplicate]  (value not drawn)
P6  solder pad rounded double sided  [solder pad double sided rounded - duplicate]  (value not drawn)
P7  solder pad rounded double sided  [solder pad double sided rounded - duplicate]  (value not drawn)
P8  solder pad rounded double sided  [solder pad double sided rounded - duplicate]  (value not drawn)
P9  solder pad rounded double sided  [solder pad double sided rounded - duplicate]  (value not drawn)
P10  solder pad rounded double sided  [solder pad double sided rounded - duplicate]  (value not drawn)
P11  solder pad rounded double sided  [solder pad double sided rounded - duplicate]  (value not drawn)
P12  solder pad rounded double sided  [solder pad double sided rounded - duplicate]  (value not drawn)
P13  solder pad rounded double sided  [solder pad double sided rounded - duplicate]  (value not drawn)
P14  solder pad rounded double sided  [solder pad double sided rounded - duplicate]  (value not drawn)
P15  solder pad rounded double sided  [solder pad double sided rounded - duplicate]  (value not drawn)
P16  solder pad rounded double sided  [solder pad double sided rounded - duplicate]  (value not drawn)
P17  solder pad rounded double sided  [solder pad double sided rounded - duplicate]  (value not drawn)
P18  solder pad rounded double sided  [solder pad double sided rounded - duplicate]  (value not drawn)
P19  solder pad rounded double sided  [solder pad double sided rounded - duplicate]  (value not drawn)
P20  solder pad square double sided  [solder pad double sided square]  (value not drawn)
P21  solder pad square double sided  [solder pad double sided square]  (value not drawn)
P22  solder pad square double sided  [solder pad double sided square]  (value not drawn)
P23  solder pad square double sided  [solder pad double sided square]  (value not drawn)
P24  solder pad square double sided  [solder pad double sided square]  (value not drawn)
P25  solder pad square double sided  [solder pad double sided square]  (value not drawn)
P26  solder pad square double sided  [solder pad double sided square]  (value not drawn)
P27  solder pad rounded double sided  [solder pad double sided rounded - duplicate]  (value not drawn)
P28  solder pad chamfered double sided  [solder pad double sided chamfered]  (value not drawn)
P29  solder pad chamfered double sided  [solder pad double sided chamfered]  (value not drawn)
P30  solder pad chamfered double sided  [solder pad double sided chamfered]  (value not drawn)
P31  solder pad chamfered double sided  [solder pad double sided chamfered]  (value not drawn)
P32  solder pad chamfered double sided  [solder pad double sided chamfered]  (value not drawn)
P33  solder pad rounded double sided  [solder pad double sided rounded - duplicate]  (value not drawn)
P34  solder pad chamfered double sided  [solder pad double sided chamfered]  (value not drawn)
P35  solder pad rounded double sided  [solder pad double sided rounded - duplicate]  (value not drawn)
P36  solder pad chamfered double sided  [solder pad double sided chamfered]  (value not drawn)
P37  solder pad rounded double sided  [solder pad double sided rounded - duplicate]  (value not drawn)
P38  solder pad rounded double sided  [solder pad double sided rounded - duplicate]  (value not drawn)
P39  solder pad rounded double sided  [solder pad double sided rounded - duplicate]  (value not drawn)
P40  solder pad rounded double sided  [solder pad double sided rounded - duplicate]  (value not drawn)
P41  solder pad rounded double sided  [solder pad double sided rounded - duplicate]  (value not drawn)
P42  solder pad chamfered double sided  [solder pad double sided chamfered]  (value not drawn)
P43  solder pad rounded double sided  [solder pad double sided rounded - duplicate]  (value not drawn)
R38  1K  [RESC0603(1608)_N]
R40  1K  [RESC1005X40X25NL05T10]
S1  Tactile Switch  [Tactile Switch]
U1  SN74AHC1G00QDCKRQ1  [FP-DCK0005A-IPC_A]

### Ports
Activity (see Main[1A], LEDs[3B], RP2040[3B]), Boot (see Main[2B]), Curr_ESC (see Main[1B], VI Sensors[2C]), Debug (see Main[2B], LEDs[3B], RP2040[3B]), IO (harness IO, see Main[2B], RP2040[1C]), Mag (harness I2C, see Main[2B]), Motor (harness Motor, see Main[2A], RP2040[4B]), Serial0 (harness UART, see Main[2A], RP2040[1B]), Serial1 (harness UART, see Main[2A], RP2040[3D]), Spk (see Main[2B]), Video (harness Video, see Main[2B], OSD[4B])

### Harnesses
Motor: M1, M2, M3, M4
UART: FCRX, FCTX
IO: IO4, IO5, IO6, IO24, IO25, IO26, IO27, SWDIO, SWCLk
Video: Video Out, Video in
I2C: SDA, SCL

### Nets
3V3: P31.1(upper) P31.2(lower) U1.5(VCC)
4V5: P34.1(upper) P34.2(lower) P36.1(upper) P36.2(lower)
5V: J2.3 P29.1(upper) P29.2(lower) P30.1(upper) P30.2(lower) P32.1(upper) P32.2(lower)
10V: J3.1 P28.1(upper) P28.2(lower)
GND: J2.4 J2.5 J2.6 J3.2 J3.5 J3.MP1 J3.MP2 P2.1 P2.MP1 P2.MP2 P20.1(upper) P20.2(lower) P21.1(upper) P21.2(lower) P22.1(upper) P22.2(lower) P23.1(upper) P23.2(lower) P24.1(upper) P24.2(lower) P25.1(upper) P25.2(lower) P26.1(upper) P26.2(lower) S1.1 S1.3(S) S1.4(S) U1.3(GND)
VBAT: P2.2 P42.1(upper) P42.2(lower) R38.2
Activity: P43.1(upper) P43.2(lower) ; port Activity
Curr_ESC: P2.8 P27.1(upper) P27.2(lower) R38.1 ; port Curr_ESC
Debug: P41.1(upper) P41.2(lower) ; port Debug
IO4: P3.1(upper) P3.2(lower) ; port IO.IO4
IO5: P2.7 P4.1(upper) P4.2(lower) ; port IO.IO5
IO6: P5.1(upper) P5.2(lower) ; port IO.IO6
IO24: J2.2 P7.1(upper) P7.2(lower) ; port IO.IO24
IO25: J2.1 P6.1(upper) P6.2(lower) ; port IO.IO25
IO26: P8.1(upper) P8.2(lower) ; port IO.IO26  [project net Gyro_Int1]
IO27: P9.1(upper) P9.2(lower) ; port IO.IO27  [project net Gyro_Int2]
M1: P2.3 P16.1(upper) P16.2(lower) ; port Motor.M1
M2: P2.4 P17.1(upper) P17.2(lower) ; port Motor.M2
M3: P2.5 P18.1(upper) P18.2(lower) ; port Motor.M3
M4: P2.6 P19.1(upper) P19.2(lower) ; port Motor.M4
SCL: P38.1(upper) P38.2(lower) ; port Mag.SCL
SDA: P37.1(upper) P37.2(lower) ; port Mag.SDA
Spk+: P33.1(upper) P33.2(lower) U1.1(A) U1.2(B) ; port Spk
Spk-: P35.1(upper) P35.2(lower) U1.4(Y)
SWCLK: P40.1(upper) P40.2(lower) ; port IO.SWCLk
SWDIO: P39.1(upper) P39.2(lower) ; port IO.SWDIO
U0RX: J3.4 P12.1(upper) P12.2(lower) ; port Serial0.FCRX
U0TX: J3.3 P13.1(upper) P13.2(lower) ; port Serial0.FCTX
U1RX: P14.1(upper) P14.2(lower) ; port Serial1.FCRX
U1TX: P15.1(upper) P15.2(lower) ; port Serial1.FCTX
Vin: P11.1(upper) P11.2(lower) ; port Video.Video in  [project net Video In]
Vout: P10.1(upper) P10.2(lower) ; port Video.Video Out  [project net Video Out]
NetIC2_1: R40.2 ; port Boot
NetR40_1: R40.1 S1.2

Not connected (* = marked no-connect by the designer): J3 6*

### Library data of the parts
J2 = SM04B-SRSS-TB_LF__SN_: Connector; Manufacturer_Name: JST (JAPAN SOLDERLESS TERMINALS); Manufacturer_Part_Number: SM04B-SRSS-TB(LF)(SN); Datasheet Link: http://www.jst-mfg.com/product/pdf/eng/eSH.pdf; Arrow Part Number: SM04B-SRSS-TB(LF)(SN); Arrow Price/Stock: https://www.arrow.com/en/products/sm04b-srss-tb-lf-sn/jst-manufacturing?region=europe
J3 = CMP-2000-07080-1: Male Header, Pitch 1 mm, 1 x 6 Position, Height 2.95 mm, -25 to 85 degC, RoHS, Tape and Reel; Manufacturer: JST; No of Positions: 6; Pitch: 1mm; Style/Orientation: RightAngleHeader/Plug; Datasheet URL: https://datasheet.ciiva.com/26894/getdatasheetpartid-708885-26894671.pdf; Package Description: Male Header, Pitch 1 mm, 1 X 6 Position, Height 2.9 mm; Termination: Solder; Manufacturer URL: http://www.jst.com/home2.html; Type: ShroudedHeader; Package Reference: SM06B-SRSS-TB; Datasheet Version: 11/2010; Mounting Technology: SurfaceMount
P2 = CMP-2000-07082-1: Male Header, Pitch 1 mm, 1 x 8 Position, Height 2.95 mm, -25 to 85 degC, RoHS, Tape and Reel; Manufacturer: JST; Style/Orientation: RightAngleHeader/Plug; Pitch: 1mm; No of Positions: 8; Manufacturer URL: http://www.jst.com/home2.html; Mounting Technology: SurfaceMount; Package Description: Male Header, Pitch 1 mm, 1 x 8 Position, Height 2.95 mm; Datasheet URL: http://www.jst-mfg.com/product/pdf/eng/eSR.pdf; Type: ShroudedHeader; Termination: Crimp; Package Reference: SM08B-SRSS-TB; Datasheet Version: 11/2010
R38 = Res 1K: as R31 on sheet Voltage Regulators; PackageReference: 0603; Value: 1K; OC_FARNELL: 9330380
R40 = CMP-1011-00001-2: as R33 on sheet Baro
U1 = CMP-0859-00415-4: IC GATE NAND 1CH 2-INP SC70-5; Number of Output Lines: 1; Max Supply Voltage: 5.5V; High Level Output Current: -8mA; Propagation Delay: 7.5ns; Min Supply Voltage: 2V; Logic Function: NAND GATE; Low Level Output Current: 8mA; Number of Inputs: 2; Quiescent Current: 1uA; Lead Free: Lead Free; Series: 74AHC; Number of Pins: 5; Number of Gates: 1; Max Operating Temperature: 125°C; Number of Elements: 1; Case/Package: SC; Packaging: Tape and Reel; Technology: CMOS; Radiation Hardening: No; Min Operating Temperature: -40°C; Output Current: 8mA; Mount: Surface Mount; Number of Bits: 1; RoHS Compliant: Yes; Number of Circuits: 1; Number of Input Lines: 2; Package Quantity: 1; Number of Outputs: 1

## Sheet VI Sensors.SchDoc
size A4; SheetNumber: 11; SheetTotal: 11
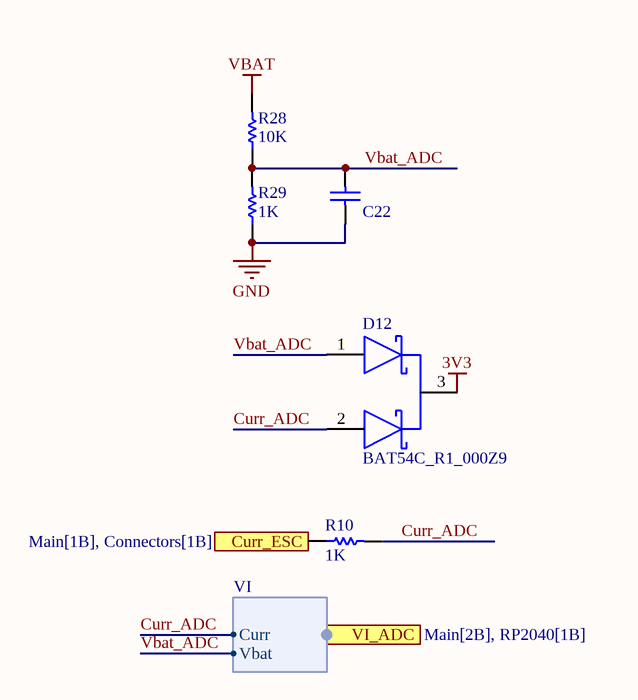
[diagram p9: VI Sensors.SchDoc]

### Parts
C22  1µF  [WCAP-CSGP_0603_L1.6W0.8H0.8_Reflow]  (value not drawn)
D12  BAT54C_R1_000Z9  [FP-SOT23-MFG]
R10  1K  [RESC0603(1608)_N]
R28  10K  [RESC0603(1608)_N]
R29  1K  [RESC0603(1608)_N]

### Ports
Curr_ESC (see Main[1B], Connectors[1B]), VI_ADC (harness VI, see Main[2B], RP2040[1B])

### Harnesses
VI: Curr, Vbat

### Nets
3V3: D12.3(COMMON_CATHODE)
GND: C22.1 R29.1
VBAT: R28.2
Curr_ADC: D12.2(2_ANODE) R10.2 ; port VI_ADC.Curr
Curr_ESC: R10.1 ; port Curr_ESC
Vbat_ADC: C22.2 D12.1(1_ANODE) R28.1 R29.2 ; port VI_ADC.Vbat

### Library data of the parts
C22 = 885012106017: as C24 on sheet Voltage Regulators; ComponentLink1Description: Website Link; ComponentLink1URL: https://www.we-online.com/redexpert/article/885012106017?ad; ComponentLink2Description: Datasheet Link; ComponentLink2URL: https://www.we-online.com/redexpert/spec/885012106017?ad; Manufacturer Part Number: 885012106017; Category: Multilayer Ceramic Chip Capacitors; Match Code: WCAP-CSGP; Mount: Surface Mount; Operating Temperature Max: 85°C; Operating Temperature Min: -55°C; Packaging: Tape and Reel; Length: 1.6mm; Width: 0.8mm; Height: 0.8mm; Capacitance: 1µF; Ceramic Type: X5R
D12 = CMP-14398-000007-1: DIODE ARRAY SCHOTTKY 30V SOT23; Manufacturer: Nexperia; Manufacturer Part Number: BAT54C,215; Automotive Grade: Grade 0; Peak Reverse Current: 2uA; Forward Current: 200mA; Max Surge Forward Current: 600mA; Value: 10pF; Max Junction Temp: +150°C; Description: Diode Array 1 Pair Common Cathode Schottky 30V 200mA (DC) Surface Mount TO-236-3, SC-59, SOT-23-3; Lead Free: Yes; Automotive: Yes; Device Class L1: Discrete Semiconductors; Digikey Description: DIODE ARRAY SCHOTTKY 30V SOT23; Reverse Voltage: 30V; ComponentLink2URL: https://assets.nexperia.com/documents/data-sheet/BAT54_SER.pdf; Device Class L2: Diodes; Category: Diode; Octopart: https://octopart.com/bat54c%2C215-nexperia-78738945; Package: SOT23; Mouser Description: Schottky Diodes, Rectifiers - Arrays SOT-23 (TO-236AB) 30V 200mA (DC) Surface Mount; RoHS: TRUE; Temperature: to +150°C; Ambient Temperature Range Low: -55°C; Height: 1.1mm; Device Class L3: Schottky Diodes; Temperature Range High: +150°C; Footprint Url: https://assets.nexperia.com/documents/outline-drawing/SOT23.pdf; Capacitance: 10pF; Ambient Temperature Range High: +150°C; Ipc Land Pattern Name: SOT95P230X100-3; ComponentLink2Description: Datasheet
R10 = Res 1K: as R31 on sheet Voltage Regulators; PackageReference: 0603; Value: 1K; OC_FARNELL: 9330380
R28 = Res 100K: as R30 on sheet Flash; PackageReference: 0603; OC_FARNELL: 9330402
R29 = Res 10K: Chipwiderstand, SMD, Baureihe MC, 1%; Manufacturer: Multicomp; Value: 10K; PackageReference: 0603; OC_FARNELL: 9330399

## Nets that join several sheets
3V3: RP2040 (18 pins), Flash (C37.2 C38.2 IC2.8 R30.2), Voltage Regulators (C20.2 IC7.1), Baro (C17.1 IC5.8 R26.2 R27.2), Gyro (C18.2 C19.2 IC6.5 IC6.8), Connectors (P31.1 P31.2 U1.5), VI Sensors (D12.3)
4V5: Voltage Regulators (6 pins), Connectors (P34.1 P34.2 P36.1 P36.2)
5V: Voltage Regulators (7 pins), OSD (10 pins), Connectors (7 pins)
10V: Voltage Regulators (C4.2 C5.2 L1.2 R1.2), Connectors (J3.1 P28.1 P28.2)
GND: RP2040 (12 pins), Flash (C37.1 C38.1 IC2.4), Voltage Regulators (32 pins), USB (9 pins), OSD (10 pins), Baro (C17.2 IC5.1 IC5.7), Gyro (C18.1 C19.1 IC6.6 IC6.7), Connectors (28 pins), VI Sensors (C22.1 R29.1)
USB5V: Voltage Regulators (D13.1), USB (D3.5 P1.2 P1.11)
VBAT: Voltage Regulators (5 pins), Connectors (P2.2 P42.1 P42.2 R38.2), VI Sensors (R28.2)
Activity: RP2040 (J1.14), Connectors (P43.1 P43.2)
CSB: RP2040 (J1.28), Gyro (IC6.12)
Curr_ADC: RP2040 (J1.40), VI Sensors (D12.2 R10.2)
Curr_ESC: Connectors (P2.8 P27.1 P27.2 R38.1), VI Sensors (R10.1)
Debug: RP2040 (J1.13), Connectors (P41.1 P41.2)
Gyro_Int1: RP2040 (J1.38), Gyro (IC6.4), Connectors (P8.1 P8.2)
Gyro_Int2: RP2040 (J1.39), Gyro (IC6.9), Connectors (P9.1 P9.2)
Gyro_MISO: RP2040 (J1.27), Gyro (IC6.1)
Gyro_MOSI: RP2040 (J1.30), Gyro (IC6.14)
Gyro_SCLK: RP2040 (J1.29), Gyro (IC6.13)
IO4: RP2040 (J1.6), Connectors (P3.1 P3.2)
IO5: RP2040 (J1.7), Connectors (P2.7 P4.1 P4.2)
IO6: RP2040 (J1.8), Voltage Regulators (R35.1), Connectors (P5.1 P5.2)
IO24: RP2040 (J1.36), Connectors (J2.2 P7.1 P7.2)
IO25: RP2040 (J1.37), Connectors (J2.1 P6.1 P6.2)
M1: RP2040 (J1.31), Connectors (P2.3 P16.1 P16.2)
M2: RP2040 (J1.32), Connectors (P2.4 P17.1 P17.2)
M3: RP2040 (J1.34), Connectors (P2.5 P18.1 P18.2)
M4: RP2040 (J1.35), Connectors (P2.6 P19.1 P19.2)
MISO: RP2040 (J1.15), OSD (IC4.11)
MOSI: RP2040 (J1.18), OSD (IC4.9)
NetIC2_1: RP2040 (J1.56), Flash (IC2.1 R30.1), Connectors (R40.2)
NetIC2_2: RP2040 (J1.55), Flash (IC2.2)
NetIC2_3: RP2040 (J1.54), Flash (IC2.3)
NetIC2_5: RP2040 (J1.53), Flash (IC2.5)
NetIC2_6: RP2040 (J1.52), Flash (IC2.6)
NetIC2_7: RP2040 (J1.51), Flash (IC2.7)
NetIC5_3: Baro (IC5.3 R27.1 R33.2), Gyro (R37.1)
NetIC5_4: Baro (IC5.4 R26.1 R36.2), Gyro (R39.1)
NetJ1_46: RP2040 (J1.46), USB (R5.1)
NetJ1_47: RP2040 (J1.47), USB (R4.1)
OSD_SCLK: RP2040 (J1.17), OSD (IC4.10)
OSD_SS: RP2040 (J1.16), OSD (IC4.8)
SCL: RP2040 (J1.5), Baro (R36.1), Connectors (P38.1 P38.2)
SDA: RP2040 (J1.4), Baro (R33.1), Connectors (P37.1 P37.2)
Spk+: RP2040 (J1.9), Connectors (P33.1 P33.2 U1.1 U1.2)
SWCLK: RP2040 (J1.24), Connectors (P40.1 P40.2)
SWDIO: RP2040 (J1.25), Connectors (P39.1 P39.2)
U0RX: RP2040 (J1.3), Connectors (J3.4 P12.1 P12.2)
U0TX: RP2040 (J1.2), Connectors (J3.3 P13.1 P13.2)
U1RX: RP2040 (J1.12), Connectors (P14.1 P14.2)
U1TX: RP2040 (J1.11), Connectors (P15.1 P15.2)
Vbat_ADC: RP2040 (J1.41), VI Sensors (C22.2 D12.1 R28.1 R29.2)
Video In: OSD (C13.2 R22.2), Connectors (P11.1 P11.2)
Video Out: OSD (R21.1), Connectors (P10.1 P10.2)